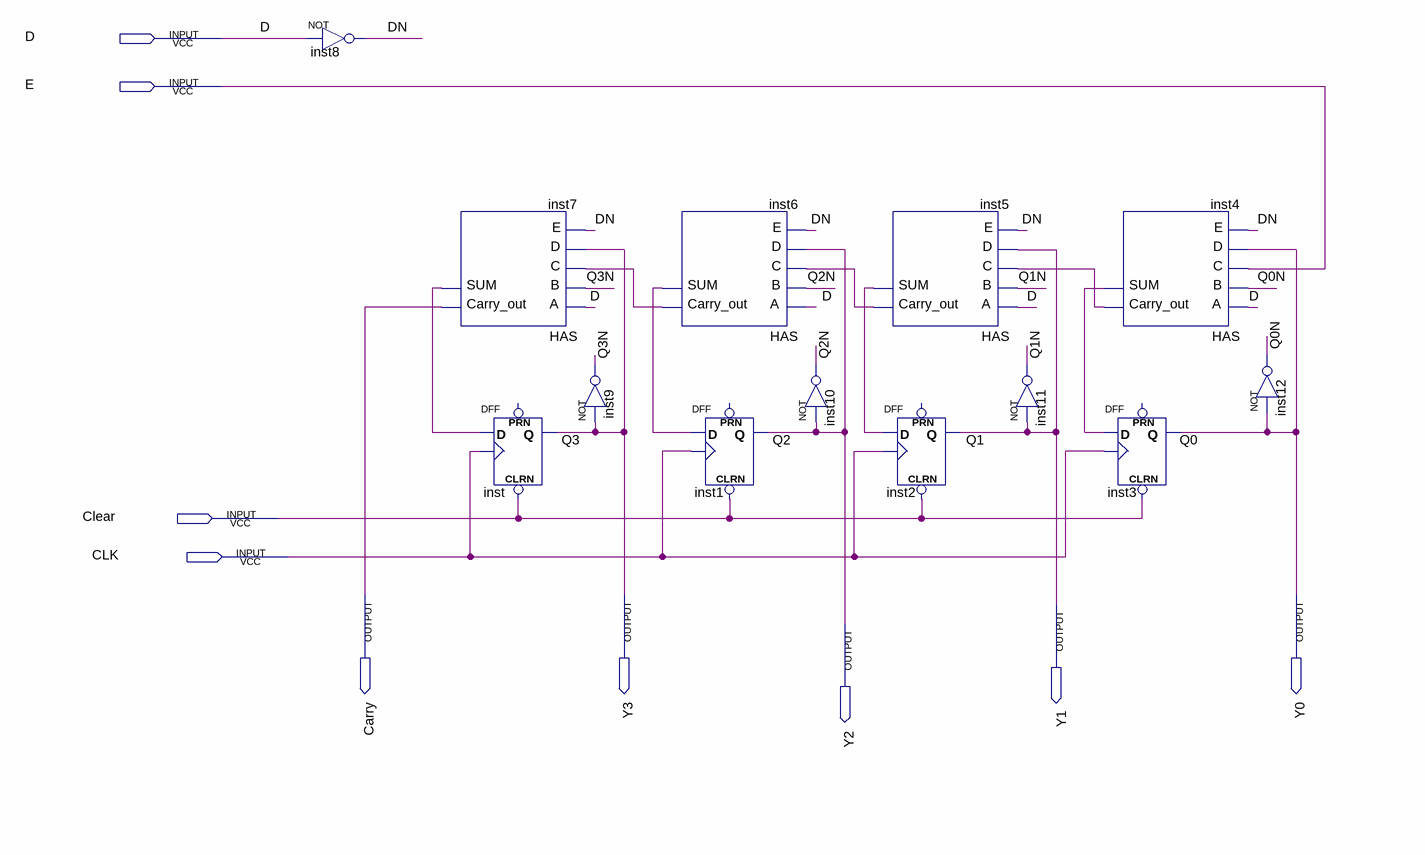
[diagram p0: schematic sheet]
// Quartus schematic Counter.bdf as structural Verilog: 13 symbols, 9 pins
module Counter (
  input  D,
  input  E,
  input  Clear,
  input  CLK,
  output Carry,
  output Y3,
  output Y0,
  output Y1,
  output Y2
);

  wire DN, inst4_carry_out, inst4_sum, inst5_carry_out, inst5_sum, inst6_carry_out, inst6_sum, inst7_sum,
       Q0N, Q1N, Q2N, Q3N;

  not inst8 (DN, D);
  HAS inst7 (.A(D), .B(Q3N), .C(inst6_carry_out), .D(Y3), .E(DN), .Carry_out(Carry), .SUM(inst7_sum));
  DFF inst (.CLRN(Clear), .CLK(CLK), .D(inst7_sum), .Q(Y3));  // open: PRN
  not inst9 (Q3N, Y3);
  HAS inst6 (.A(D), .B(Q2N), .C(inst5_carry_out), .D(Y2), .E(DN), .Carry_out(inst6_carry_out), .SUM(inst6_sum));
  DFF inst1 (.CLRN(Clear), .CLK(CLK), .D(inst6_sum), .Q(Y2));  // open: PRN
  not inst10 (Q2N, Y2);
  HAS inst5 (.A(D), .B(Q1N), .C(inst4_carry_out), .D(Y1), .E(DN), .Carry_out(inst5_carry_out), .SUM(inst5_sum));
  DFF inst2 (.CLRN(Clear), .CLK(CLK), .D(inst5_sum), .Q(Y1));  // open: PRN
  not inst11 (Q1N, Y1);
  HAS inst4 (.A(D), .B(Q0N), .C(E), .D(Y0), .E(DN), .Carry_out(inst4_carry_out), .SUM(inst4_sum));
  DFF inst3 (.CLRN(Clear), .CLK(CLK), .D(inst4_sum), .Q(Y0));  // open: PRN
  not inst12 (Q0N, Y0);

  // Other names for the same wires on the sheet: Q0 = Y0; Q1 = Y1; Q2 = Y2; Q3 = Y3
endmodule
